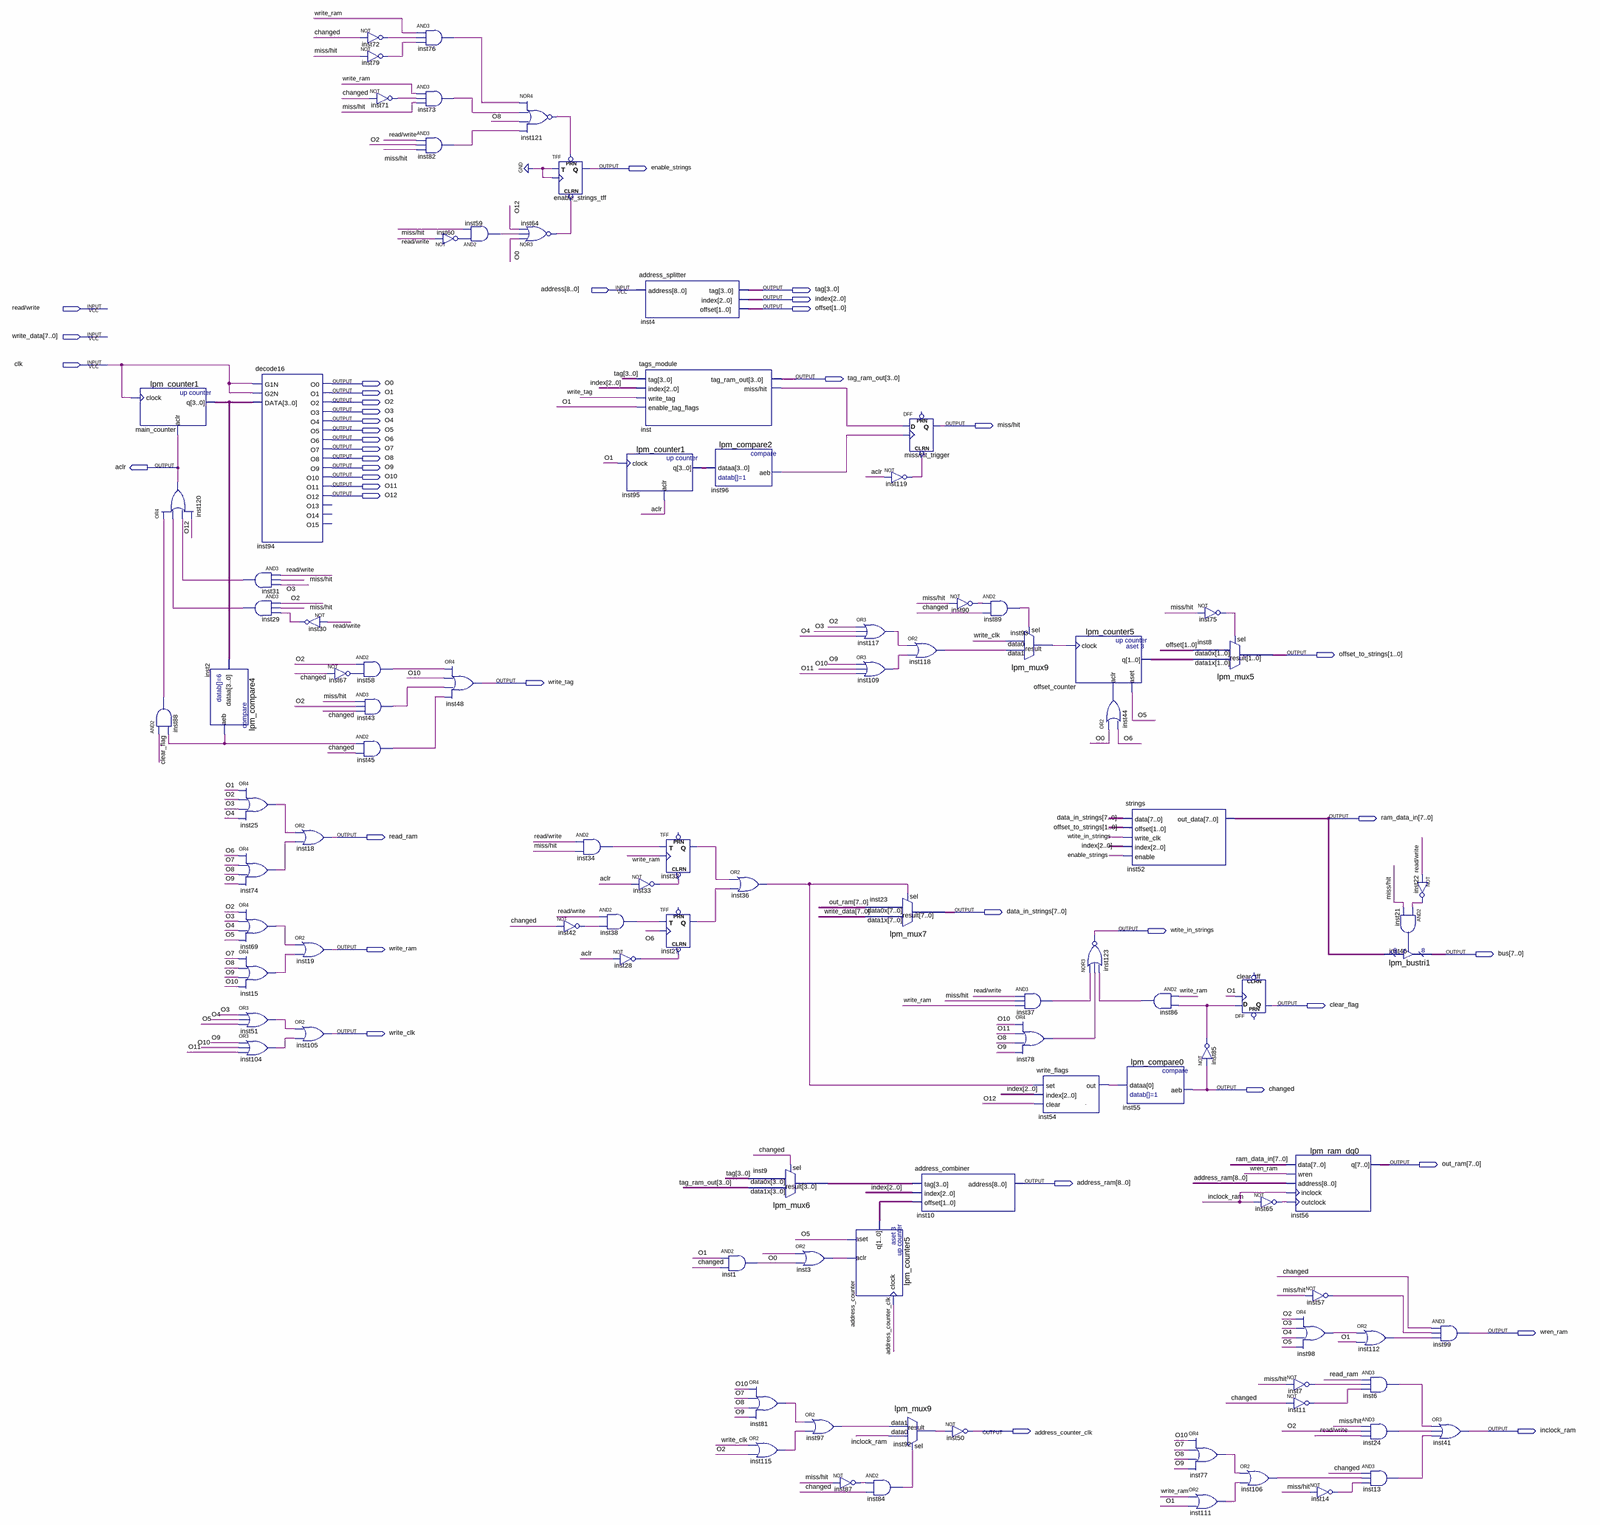
[diagram p0: schematic sheet, whole]
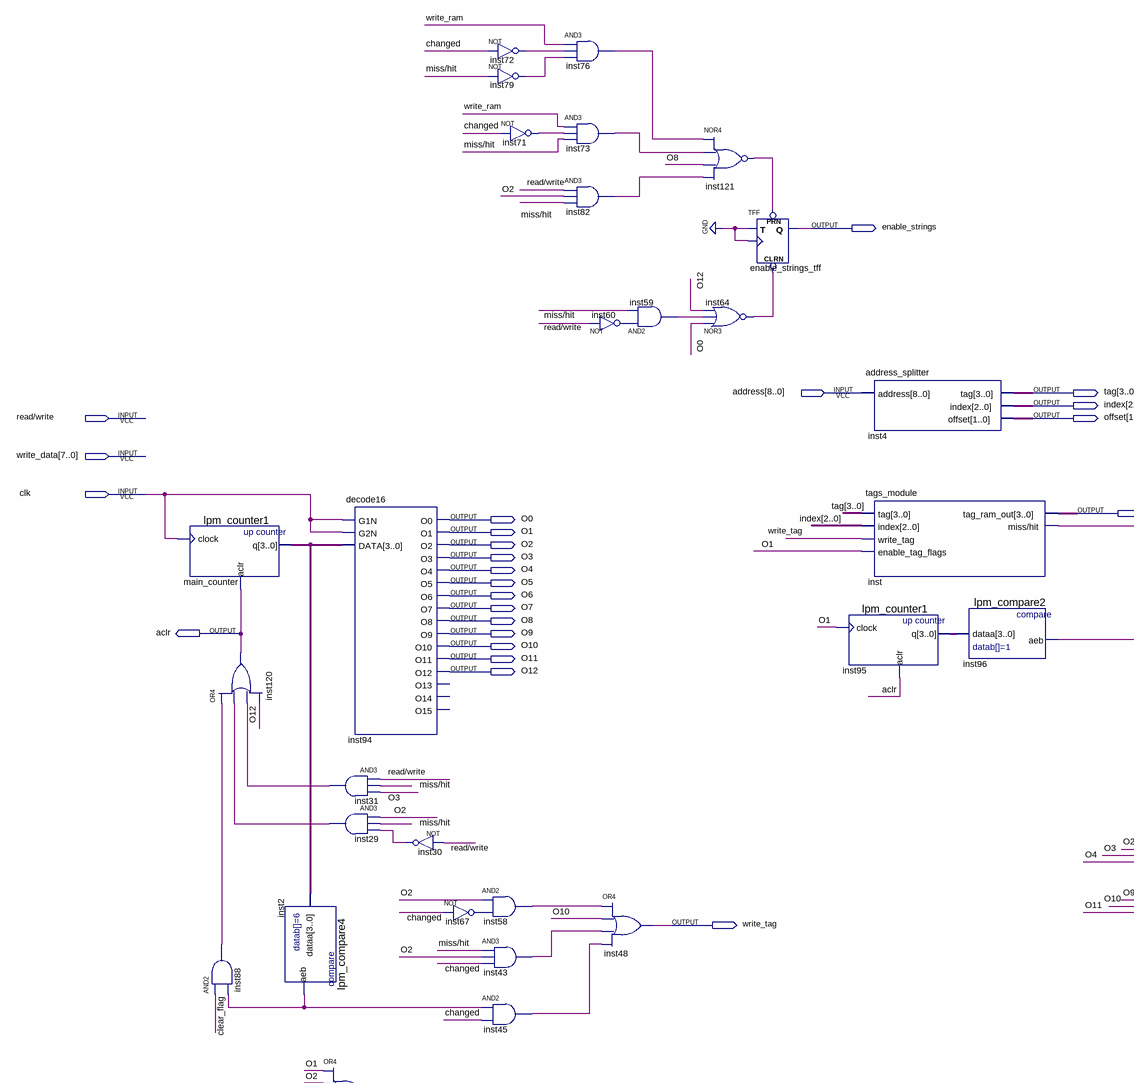
[diagram p1: schematic sheet, upper left part]
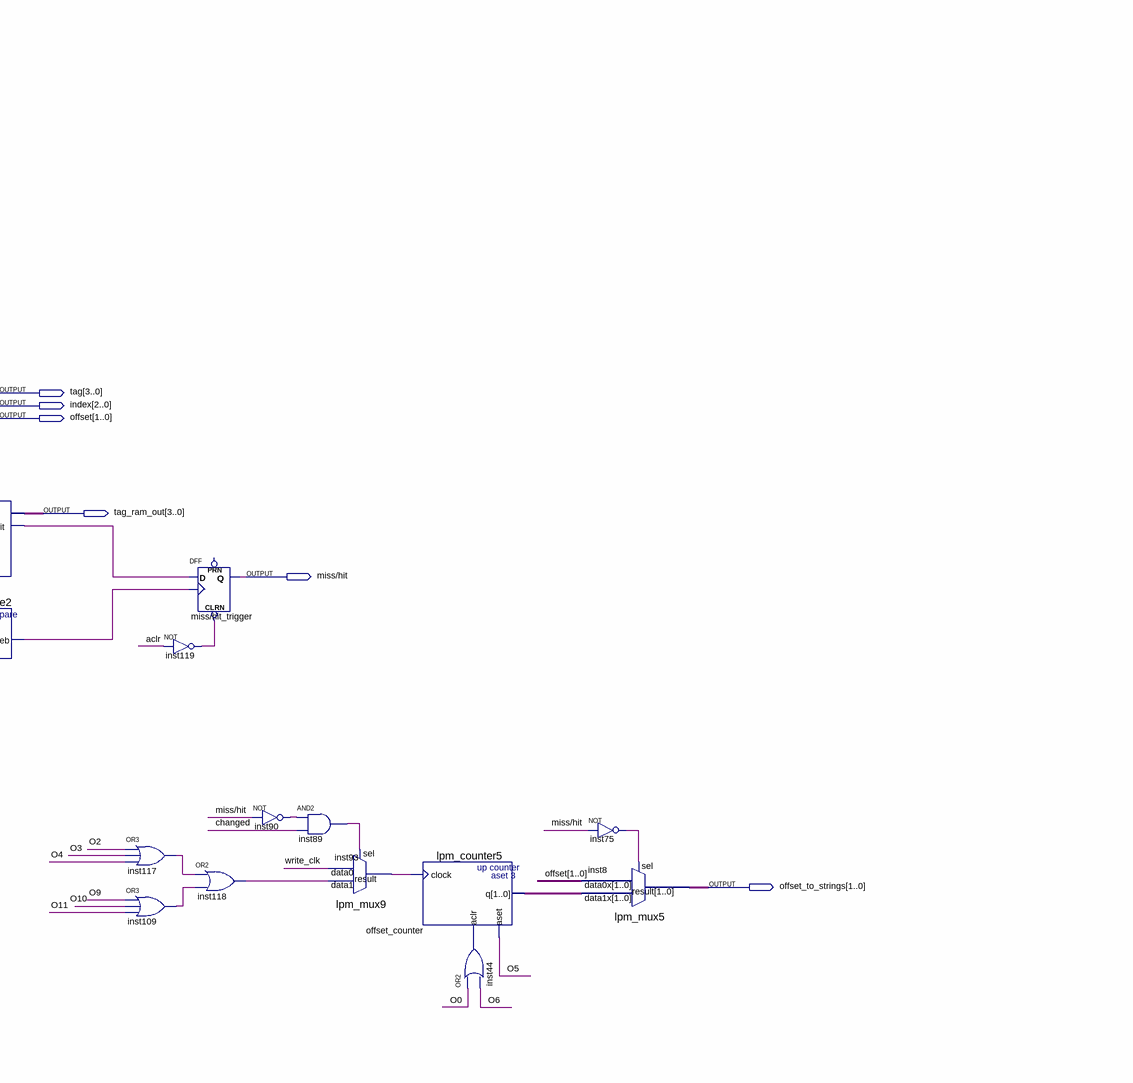
[diagram p2: schematic sheet, upper right part]
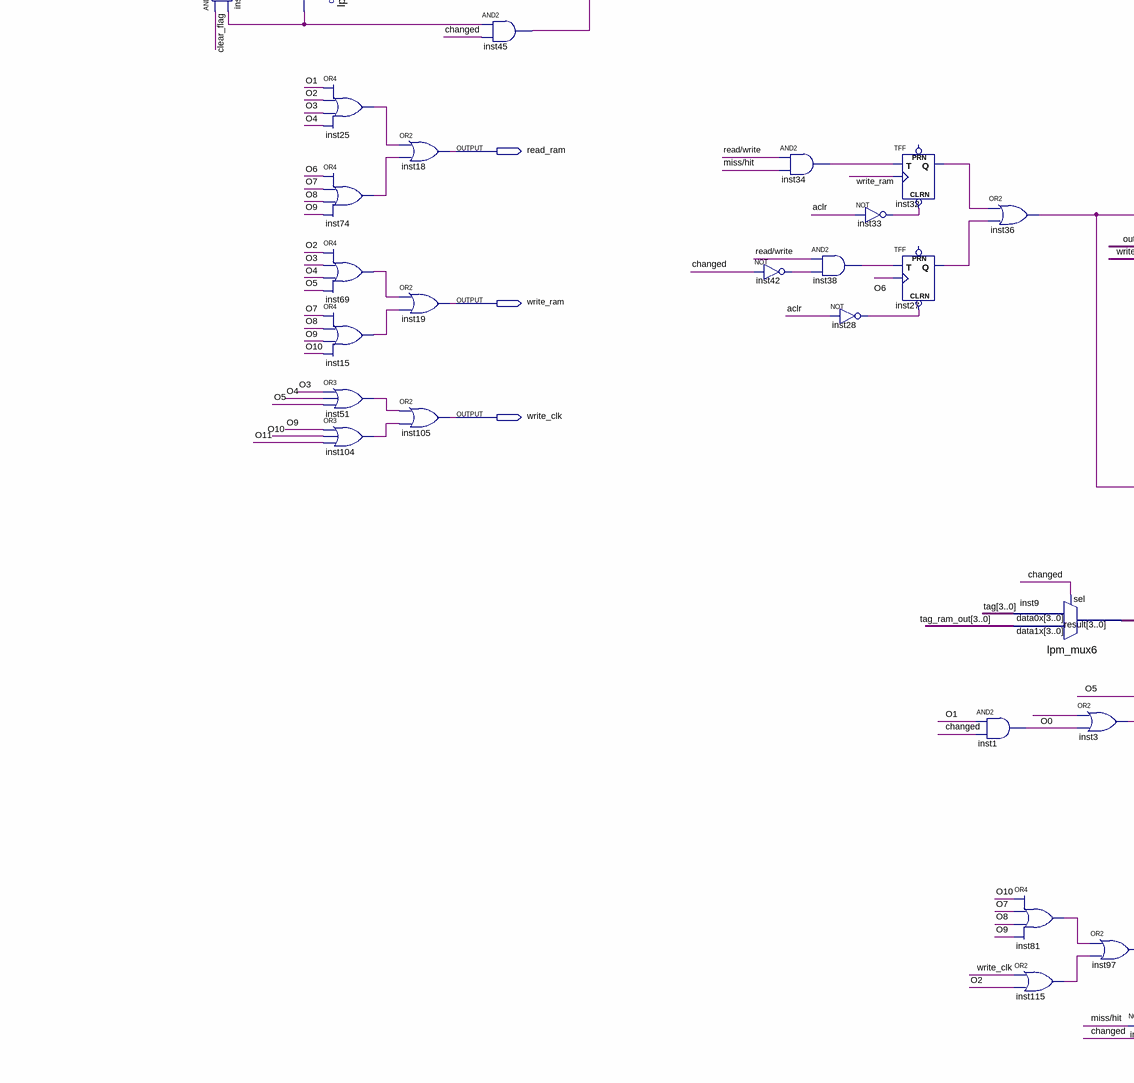
[diagram p3: schematic sheet, lower left part]
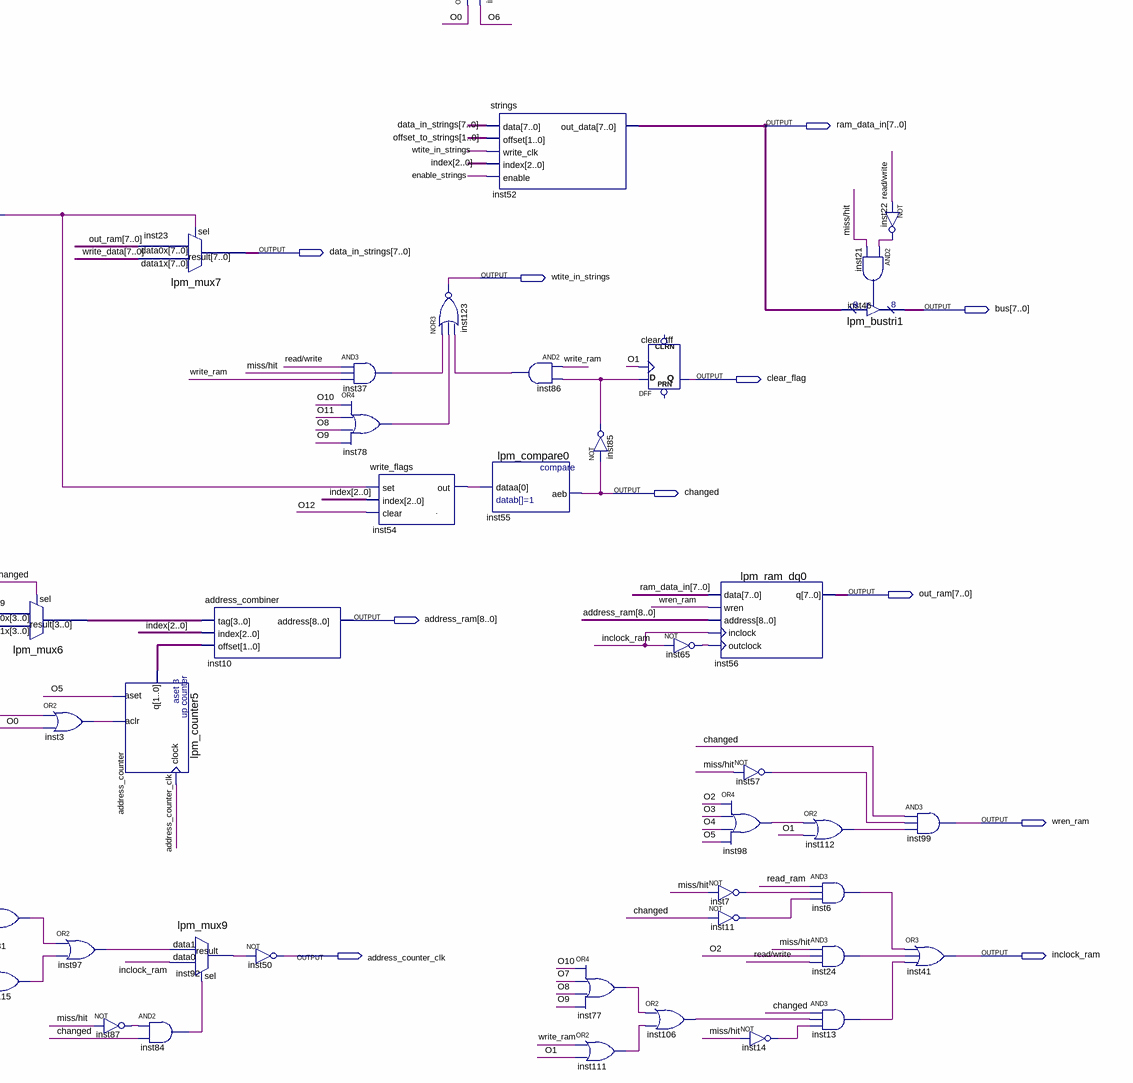
[diagram p4: schematic sheet, lower right part]
// Quartus schematic cache.bdf as structural Verilog: 98 symbols, 40 pins
module cache (
  input  [8:0] address,
  input  \read/write ,
  input  [7:0] write_data,
  input  clk,
  output enable_strings,
  output [3:0] tag,
  output [2:0] index,
  output [1:0] offset,
  output [3:0] tag_ram_out,
  output O0,
  output O1,
  output O2,
  output O3,
  output O4,
  output \miss/hit ,
  output O5,
  output O6,
  output O7,
  output O8,
  output aclr,
  output O9,
  output O10,
  output O11,
  output O12,
  output [1:0] offset_to_strings,
  output write_tag,
  output [7:0] ram_data_in,
  output read_ram,
  output [7:0] data_in_strings,
  output wtite_in_strings,
  output write_ram,
  output [7:0] bus,
  output clear_flag,
  output write_clk,
  output changed,
  output [7:0] out_ram,
  output [8:0] address_ram,
  output wren_ram,
  output address_counter_clk,
  output inclock_ram
);

  wire inst1_out, inst2_aeb, inst3_out, inst6_out, inst7_out, inst11_out, inst13_out, inst14_out, inst15_out,
       inst21_out, inst22_out, inst24_out, inst25_out, inst27_q, inst28_out, inst29_out, inst30_out,
       inst31_out, inst32_q, inst33_out, inst34_out, inst36_out, inst37_out, inst38_out, inst42_out,
       inst43_out, inst44_out, inst45_out, inst51_out, inst54_out, inst57_out, inst58_out, inst59_out,
       inst60_out, inst64_out, inst65_out, inst67_out, inst69_out, inst71_out, inst72_out, inst73_out,
       inst74_out, inst75_out, inst76_out, inst77_out, inst78_out, inst79_out, inst81_out, inst82_out,
       inst84_out, inst85_out, inst86_out, inst87_out, inst88_out, inst89_out, inst90_out, inst92_result,
       inst93_result, inst96_aeb, inst97_out, inst98_out, inst104_out, inst106_out, inst109_out, inst111_out,
       inst112_out, inst115_out, inst117_out, inst118_out, inst119_out, inst121_out, inst_miss_hit;
  wire [1:0] address_counter_q, offset_counter_q;
  wire [3:0] inst9_result, inst95_q, main_counter_q;

  lpm_counter1 main_counter (.clock(clk), .aclr(aclr), .q(main_counter_q));
  or inst120 (aclr, inst88_out, inst29_out, inst31_out, O12);
  and inst88 (inst88_out, clear_flag, inst2_aeb);
  lpm_compare4 inst2 (.dataa(main_counter_q), .aeb(inst2_aeb));
  decode16 inst94 (
    .G1N(clk), .G2N(clk), .DATA(main_counter_q), .O0(O0), .O1(O1), .O2(O2), .O3(O3), .O4(O4), .O5(O5),
    .O6(O6), .O7(O7), .O8(O8), .O9(O9), .O10(O10), .O11(O11), .O12(O12));  // open: O13, O14, O15
  and inst31 (inst31_out, \read/write , \miss/hit , O3);
  and inst29 (inst29_out, O2, \miss/hit , inst30_out);
  or inst25 (inst25_out, O1, O2, O3, O4);
  or inst74 (inst74_out, O6, O7, O8, O9);
  or inst69 (inst69_out, O2, O3, O4, O5);
  or inst15 (inst15_out, O7, O8, O9, O10);
  or inst51 (inst51_out, O3, O4, O5);
  or inst104 (inst104_out, O9, O10, O11);
  not inst30 (inst30_out, \read/write );
  or inst18 (read_ram, inst25_out, inst74_out);
  or inst19 (write_ram, inst69_out, inst15_out);
  or inst105 (write_clk, inst51_out, inst104_out);
  not inst67 (inst67_out, changed);
  not inst72 (inst72_out, changed);
  not inst79 (inst79_out, \miss/hit );
  not inst71 (inst71_out, changed);
  and inst58 (inst58_out, O2, inst67_out);
  and inst43 (inst43_out, \miss/hit , O2, changed);
  and inst45 (inst45_out, inst2_aeb, changed);
  and inst76 (inst76_out, write_ram, inst72_out, inst79_out);
  and inst73 (inst73_out, write_ram, inst71_out, \miss/hit );
  and inst82 (inst82_out, \read/write , O2, \miss/hit );
  not inst60 (inst60_out, \read/write );
  or inst48 (write_tag, inst58_out, O10, inst43_out, inst45_out);
  and inst59 (inst59_out, inst60_out, \miss/hit );
  nor inst121 (inst121_out, inst76_out, inst73_out, O8, inst82_out);
  nor inst64 (inst64_out, O0, inst59_out, O12);
  TFF enable_strings_tff (.PRN(inst121_out), .CLRN(inst64_out), .T(1'b0), .CLK(1'b0), .Q(enable_strings));
  not inst42 (inst42_out, changed);
  and inst34 (inst34_out, \read/write , \miss/hit );
  and inst38 (inst38_out, \read/write , inst42_out);
  address_splitter inst4 (.address(address), .tag(tag), .index(index), .offset(offset));
  tags_module inst (
    .tag(tag), .index(index), .write_tag(write_tag), .enable_tag_flags(O1), .tag_ram_out(tag_ram_out),
    .\miss/hit (inst_miss_hit));
  lpm_counter1 inst95 (.clock(O1), .aclr(aclr), .q(inst95_q));
  not inst33 (inst33_out, aclr);
  not inst28 (inst28_out, aclr);
  TFF inst32 (.CLRN(inst33_out), .T(inst34_out), .CLK(write_ram), .Q(inst32_q));  // open: PRN
  TFF inst27 (.CLRN(inst28_out), .T(inst38_out), .CLK(O6), .Q(inst27_q));  // open: PRN
  lpm_compare2 inst96 (.dataa(inst95_q), .aeb(inst96_aeb));
  or inst36 (inst36_out, inst32_q, inst27_q);
  lpm_mux6 inst9 (.data1x(tag_ram_out), .data0x(tag), .sel(changed), .result(inst9_result));
  and inst1 (inst1_out, O1, changed);
  or inst81 (inst81_out, O10, O7, O8, O9);
  or inst115 (inst115_out, write_clk, O2);
  or inst3 (inst3_out, O0, inst1_out);
  or inst97 (inst97_out, inst81_out, inst115_out);
  or inst117 (inst117_out, O2, O3, O4);
  or inst109 (inst109_out, O9, O10, O11);
  lpm_mux7 inst23 (.data1x(write_data), .data0x(out_ram), .sel(inst36_out), .result(data_in_strings));
  lpm_counter5 address_counter (.clock(address_counter_clk), .aclr(inst3_out), .aset(O5), .q(address_counter_q));
  and inst84 (inst84_out, inst87_out, changed);
  not inst87 (inst87_out, \miss/hit );
  DFF \miss/hit_trigger  (.CLRN(inst119_out), .CLK(inst96_aeb), .D(inst_miss_hit), .Q(\miss/hit ));  // open: PRN
  not inst119 (inst119_out, aclr);
  lpm_mux9 inst92 (.data1(inst97_out), .data0(inclock_ram), .sel(inst84_out), .result(inst92_result));
  or inst118 (inst118_out, inst117_out, inst109_out);
  address_combiner inst10 (.tag(inst9_result), .index(index), .offset(address_counter_q), .address(address_ram));
  not inst90 (inst90_out, \miss/hit );
  not inst50 (address_counter_clk, inst92_result);
  and inst89 (inst89_out, inst90_out, changed);
  lpm_mux9 inst93 (.data1(inst118_out), .data0(write_clk), .sel(inst89_out), .result(inst93_result));
  and inst37 (inst37_out, \read/write , \miss/hit , write_ram);
  or inst78 (inst78_out, O10, O11, O8, O9);
  write_flags inst54 (.set(inst36_out), .index(index), .clear(O12), .out(inst54_out));
  lpm_counter5 offset_counter (.clock(inst93_result), .aclr(inst44_out), .aset(O5), .q(offset_counter_q));
  nor inst123 (wtite_in_strings, inst37_out, inst78_out, inst86_out);
  or inst44 (inst44_out, O0, O6);
  strings inst52 (
    .data(data_in_strings), .offset(offset_to_strings), .write_clk(wtite_in_strings), .index(index),
    .enable(enable_strings), .out_data(ram_data_in));
  lpm_compare0 inst55 (.dataa(inst54_out), .aeb(changed));
  and inst86 (inst86_out, write_ram, inst85_out);
  not inst75 (inst75_out, \miss/hit );
  lpm_mux5 inst8 (.data1x(offset_counter_q), .data0x(offset), .sel(inst75_out), .result(offset_to_strings));
  not inst85 (inst85_out, changed);
  or inst77 (inst77_out, O10, O7, O8, O9);
  or inst111 (inst111_out, write_ram, O1);
  DFF clear_tff (.CLK(O1), .D(inst85_out), .Q(clear_flag));  // open: CLRN, PRN
  or inst106 (inst106_out, inst77_out, inst111_out);
  not inst65 (inst65_out, inclock_ram);
  lpm_ram_dq0 inst56 (
    .data(ram_data_in), .wren(wren_ram), .address(address_ram), .inclock(inclock_ram), .outclock(inst65_out),
    .q(out_ram));
  not inst57 (inst57_out, \miss/hit );
  or inst98 (inst98_out, O2, O3, O4, O5);
  not inst7 (inst7_out, \miss/hit );
  not inst11 (inst11_out, changed);
  not inst14 (inst14_out, \miss/hit );
  lpm_bustri1 inst46 (.enabledt(inst21_out), .data(ram_data_in), .tridata(bus));
  or inst112 (inst112_out, inst98_out, O1);
  and inst6 (inst6_out, read_ram, inst7_out, inst11_out);
  and inst24 (inst24_out, \miss/hit , O2, \read/write );
  and inst13 (inst13_out, changed, inst106_out, inst14_out);
  not inst22 (inst22_out, \read/write );
  and inst21 (inst21_out, inst22_out, \miss/hit );
  and inst99 (wren_ram, changed, inst57_out, inst112_out);
  or inst41 (inclock_ram, inst6_out, inst24_out, inst13_out);

  // Notes on the sheet:
  //   .
endmodule
